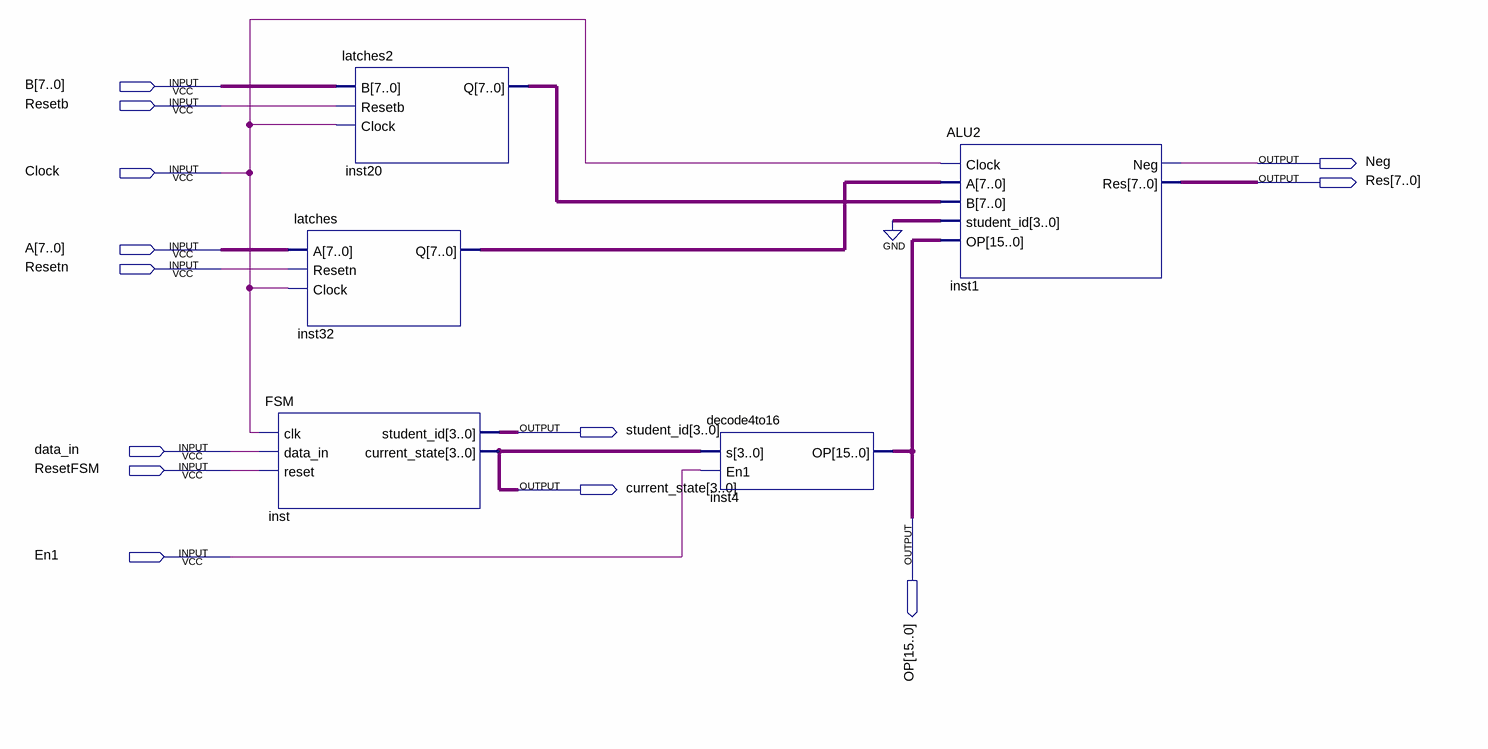
[diagram p0: schematic sheet]
// Quartus schematic Arjen_Arumalingam_Lab6.bdf as structural Verilog: 5 symbols, 13 pins
module Arjen_Arumalingam_Lab6 (
  input  [7:0] B,
  input  Resetb,
  input  Clock,
  input  [7:0] A,
  input  Resetn,
  input  data_in,
  input  ResetFSM,
  input  En1,
  output Neg,
  output [7:0] Res,
  output [3:0] student_id,
  output [3:0] current_state,
  output [15:0] OP
);

  wire [7:0] inst20_q, inst32_q;

  FSM inst (.clk(Clock), .data_in(data_in), .reset(ResetFSM), .student_id(student_id), .current_state(current_state));
  latches2 inst20 (.B(B), .Resetb(Resetb), .Clock(Clock), .Q(inst20_q));
  latches inst32 (.A(A), .Resetn(Resetn), .Clock(Clock), .Q(inst32_q));
  decode4to16 inst4 (.s(current_state), .En1(En1), .OP(OP));
  ALU2 inst1 (.Clock(Clock), .A(inst32_q), .B(inst20_q), .student_id(4'b0000), .OP(OP), .Neg(Neg), .Res(Res));
endmodule
